# Altium schematic sheet LEDMiniCube_PowerAndAnalog.SchDoc
size A4
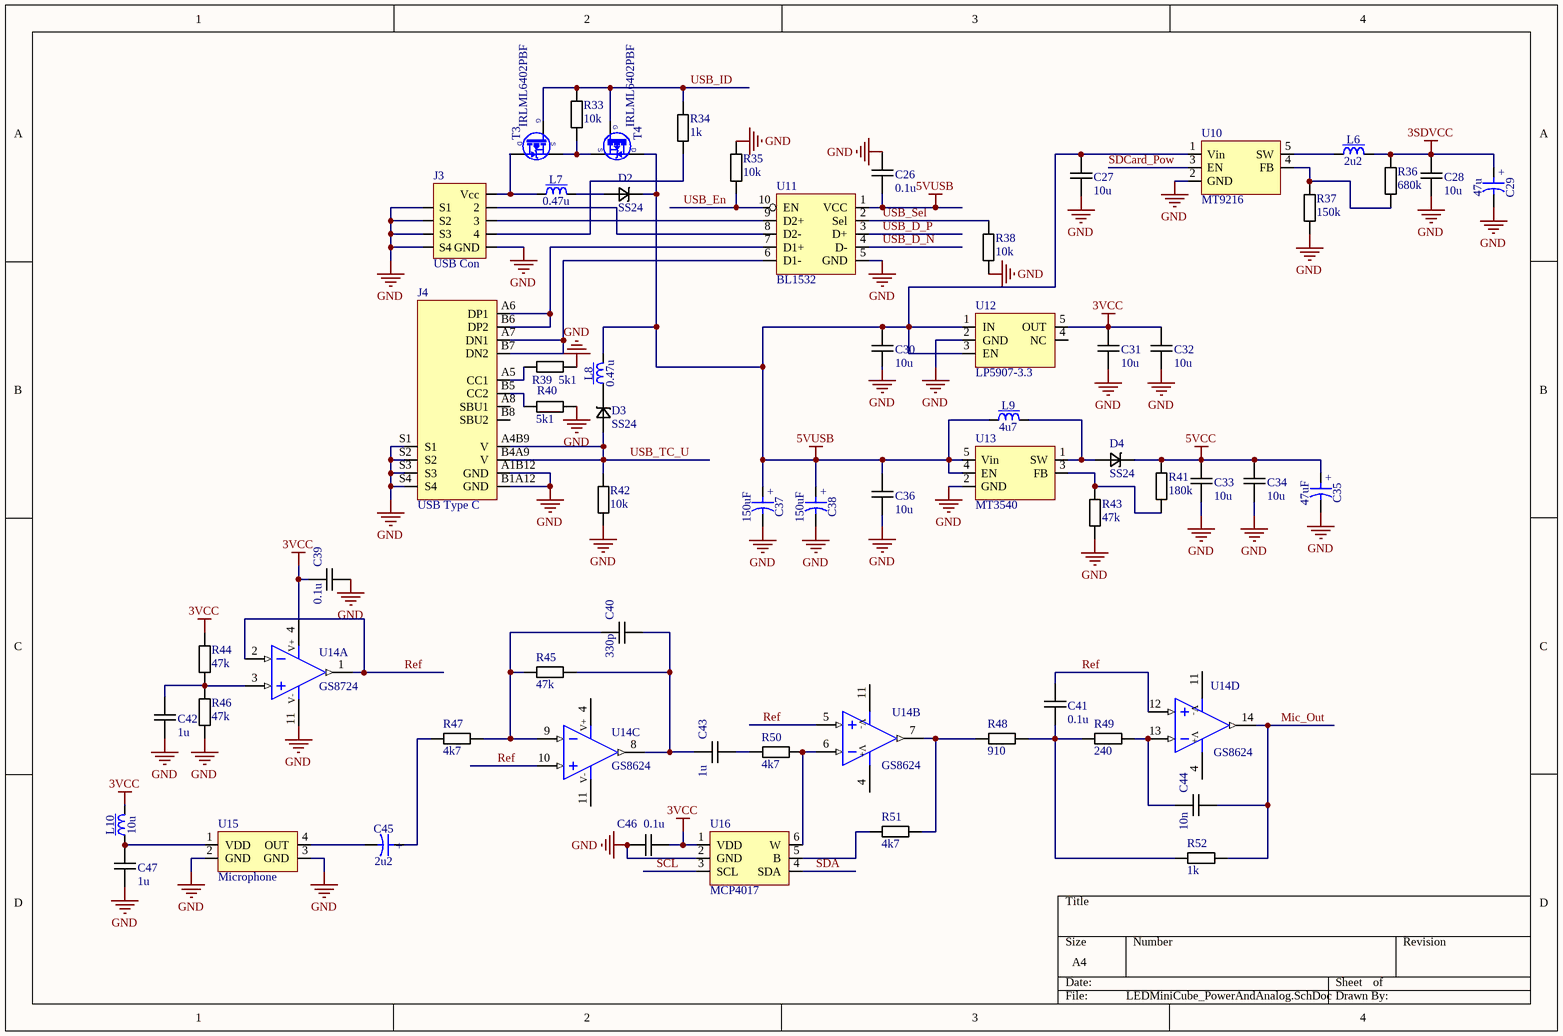
[diagram p0: LEDMiniCube_PowerAndAnalog.SchDoc]

## Parts
C26  0.1u  [CAPC1608L]
C27  10u  [CAPC2012L]
C28  10u  [CAPC2012L]
C29  47u  [CAPMP3216X180N]
C30  10u  [CAPC2012L]
C31  10u  [CAPC2012L]
C32  10u  [CAPC2012L]
C33  10u  [CAPC3216L]
C34  10u  [CAPC3216L]
C35  47uF  [CAPMP3528X120N]
C36  10u  [CAPC2012L]
C37  150uF  [CAPMP7343X200N]
C38  150uF  [CAPMP7343X200N]
C39  0.1u  [CAPC1608L]
C40  330p  [CAPC1608L]
C41  0.1u  [CAPC1608L]
C42  1u  [CAPC1608L]
C43  1u  [CAPC2012L]
C44  10n  [CAPC1608L]
C45  2u2  [CAPMP3216X180N]
C46  0.1u  [CAPC1608L]
C47  1u  [CAPC1608L]
D2  SS24  [SOD-123F]
D3  SS24  [SOD-123F]
D4  SS24  [SOD-123F]
J3  USB Con  [ZX62D]
J4  USB Type C  [U262-161N-4BVC11]
L6  2u2  [IND_COILCRAFT_1206CS]
L7  0.47u  [IND_COILCRAFT_0805CS]
L8  0.47u  [IND_COILCRAFT_0805CS]
L9  4u7  [IND_COILCRAFT_1206CS]
L10  10u  [INDC2012L]
R33  10k  [RESC1608L]
R34  1k  [RESC1608L]
R35  10k  [RESC1608L]
R36  680k  [RESC1608L]
R37  150k  [RESC1608L]
R38  10k  [RESC1608L]
R39  5k1  [RESC1608L]
R40  5k1  [RESC1608L]
R41  180k  [RESC1608L]
R42  10k  [RESC1608L]
R43  47k  [RESC1608L]
R44  47k  [RESC1608L]
R45  47k  [RESC1608L]
R46  47k  [RESC1608L]
R47  4k7  [RESC1608L]
R48  910  [RESC1608L]
R49  240  [RESC1608L]
R50  4k7  [RESC1608L]
R51  4k7  [RESC1608L]
R52  1k  [RESC1608L]
T3  IRLML6402PBF  [SOT95P237X112-3N]
T4  IRLML6402PBF  [SOT95P237X112-3N]
U10  MT9216  [SOT23-5AL]
U11  BL1532  [TSSOP50P490X110-10N]
U12  LP5907-3.3  [SOT95P280X145-5M]
U13  MT3540  [SOT23-5AL]
U14  GS8724  [SOP65P640X120-14N]  (parts A,B,C,D of 4)
U15  Microphone  [Microphone 3.76x2.95]
U16  MCP4017  [SOT65P210X110-6M]

## Nets
3SDVCC: C28.2 C29.1 L6.2 R36.2
3VCC: C31.2 C32.2 C39.1 C46.2 L10.2 R44.2 U12.5(OUT) U14.4(V+) U16.1(VDD)
5VCC: C33.2 C34.2 C35.1 D4.2 R41.2
5VUSB: C26.1 C27.2 C30.2 C36.2 C37.1 C38.1 D2.2 L8.2 L9.1 T4.3(D) U10.1(Vin) U11.1(VCC) U12.1(IN) U12.3(EN) U13.4(EN) U13.5(Vin)
GND: C26.2 C27.1 C28.1 C29.2 C30.1 C31.1 C32.1 C33.1 C34.1 C35.2 C36.1 C37.2 C38.2 C39.2 C42.1 C46.1 C47.1 J3.5(GND) J3.S1 J3.S2 J3.S3 J3.S4 J4.A1B12(GND) J4.B1A12(GND) J4.S1 J4.S2 J4.S3 J4.S4 R35.2 R37.1 R38.1 R39.2 R40.2 R42.1 R43.1 R46.1 U10.2(GND) U11.5(GND) U12.2(GND) U13.2(GND) U14.11(V-) U15.2(GND) U15.3(GND) U16.2(GND)
Mic_Out: C44.2 R52.2 U14.14(OUT)
Ref: C41.2 U14.1(OUT) U14.2(IN-) U14.5(IN+) U14.10(IN+) U14.12(IN+)
SCL: U16.3(SCL)
SDA: U16.4(SDA)
SDCard_Pow: U10.3(EN)
USB_D_N: U11.4(D-)
USB_D_P: U11.3(D+)
USB_En: R35.1 U11.10(EN)
USB_ID: R33.2 R34.2 T3.1(G) T4.1(G)
USB_Sel: R38.2 U11.2(Sel)
USB_TC_U: D3.1 J4.A4B9(V) J4.B4A9(V) R42.2
NetC40_1: C40.1 R45.1 R47.2 U14.9(IN-)
NetC40_2: C40.2 C43.1 R45.2 U14.8(OUT)
NetC41_1: C41.1 R48.2 R49.1 R52.1
NetC42_2: C42.2 R44.1 R46.2 U14.3(IN+)
NetC43_2: C43.2 R50.1
NetC44_1: C44.1 R49.2 U14.13(IN-)
NetC45_1: C45.1 R47.1
NetC45_2: C45.2 U15.4(OUT)
NetC47_2: C47.2 L10.1 U15.1(VDD)
NetD2_1: D2.1 L7.2
NetD3_2: D3.2 L8.1
NetD4_1: D4.1 L9.2 U13.1(SW)
NetJ3_1: J3.1(Vcc) L7.1 T3.3(D)
NetJ3_2: J3.2 U11.8(D2-)
NetJ3_3: J3.3 U11.9(D2+)
NetJ3_4: J3.4 R34.1
NetJ4_A5: J4.A5(CC1) R39.1
NetJ4_A6: J4.A6(DP1) J4.B6(DP2) U11.7(D1+)
NetJ4_A7: J4.A7(DN1) J4.B7(DN2) U11.6(D1-)
NetJ4_B5: J4.B5(CC2) R40.1
NetL6_1: L6.1 U10.5(SW)
NetR33_1: R33.1 T3.2(S) T4.2(S)
NetR36_1: R36.1 R37.2 U10.4(FB)
NetR41_1: R41.1 R43.2 U13.3(FB)
NetR48_1: R48.1 R51.2 U14.7(OUT)
NetR50_2: R50.2 U14.6(IN-) U16.6(W)
NetR51_1: R51.1 U16.5(B)

Not connected (* = marked no-connect by the designer): J4 A8(SBU1) B8(SBU2); U12 4(NC)

## Notes on the sheet
- (in symbol CAEM7343-20_150UF_2V_20%_LESR0009) +
- (in symbol CTE3216-18_100UF_6.3V_20%_ESR0500_AVX_TLJ) +
- (in symbol CTE3528-12_47UF_10V_20%_PANASONIC_TPG) +

## Library data of the parts
C26-C28 C30-C34 C36 C39-C44 C46 C47 = Capacitor: Name: *; Case: *
  C26 C39 C41 C46: Value: 0.1u
  C27 C28 C30-C34 C36: Value: 10u
  C40: Value: 330p
  C42 C43 C47: Value: 1u
  C44: Value: 10n
C29 C45 = CTE3216-18_100UF_6.3V_20%_ESR0500_AVX_TLJ: Polarised capacitor; Part Description: ESR 0R5 Solid Tantalum Chip Capacitor; Manufacturer: AVX; Manufacturer Part Number: TLJA107M006R0500; Voltage: 6.3V; Tolerance: ±20%; Part Number: CTE3216-18_100UF_6.3V_20%_ESR0500_AVX_TLJ; Component Kind: Standard; Component Type: Standard; Pin Count: 2; Status: None; Case: A; Mounted: Yes; Socket: No; SMD: Yes; Sense: No; ComponentHeight: 1.8mm; HelpURL: \\cern.ch\dfs\Applications\Altium\Datasheets\CTE_AVX_TLJ.pdf; Author: CERN DEM JLC; CreateDate: 19.12.2013; LatestRevisionDate: 19.12.2013
  C29: Value: 47u
  C45: Value: 2u2
C35 = CTE3528-12_47UF_10V_20%_PANASONIC_TPG: Polarised capacitor; Voltage: 10V; Value: 47uF; Case: B; Author: CERN DEM JLC
C37 C38 = CAEM7343-20_150UF_2V_20%_LESR0009: Polarised capacitor; Voltage: 6.3V; Value: 150uF; Author: CERN DEM JLC
D2-D4 = Schotky: Name: SS24; Case: *; Value: *
J3 = USB: Case: *; Name: *; Datasheet: https://media.digikey.com/pdf/Data%20Sheets/Hirose%20PDFs/ZX62D-AB-5P8%20RoHS.pdf
J4 = USB_TypeC: Name: USB Type C; Part: U262-161N-4BVC11
L6 L9 L10 = IND_620NH_5%_COILCRAFT_1206CS: Inductor With Core; Author: CERN DEM JLC
  L6: Value: 2u2
  L9: Value: 4u7
  L10: Value: 10u
L7 L8 = IND_150NH_2%_COILCRAFT_0805CS: Inductor With Core; Value: 0.47u; Author: CERN DEM JLC
R33-R52 = Resistor: Model: *; Case: *
  R33 R35 R38 R42: Value: 10k
  R34 R52: Value: 1k
  R36: Value: 680k
  R37: Value: 150k
  R39 R40: Value: 5k1
  R41: Value: 180k
  R43-R46: Value: 47k
  R47 R50 R51: Value: 4k7
  R48: Value: 910
  R49: Value: 240
T3 T4 = IRLML6402PBF: P-CHANNEL MOSFET WITH ZENER DIODE; Part Number: IRLML6402PBF; Device: IRLML6402PBF; Author: CERN DEM JLC
U10 = LM3671: Name: MT9216
U12 = TLV70233: Part: LP5907MFX-3.3/NOPB; Name: LP5907-3.3
U13 = TPS6104x: Name: MT3540
U14 = AD8624ARUZ: Quad Operational Amplifier; Part Number: GS8624-TR; Device: GS8724; Author: CERN DEM JLC
U15 = Microphone MEMS: Part: *; Name: Microphone
U11 = BL1532: Name: BL1532; Part: *
U16 = MCP4017: Part: *; Name: MCP4017